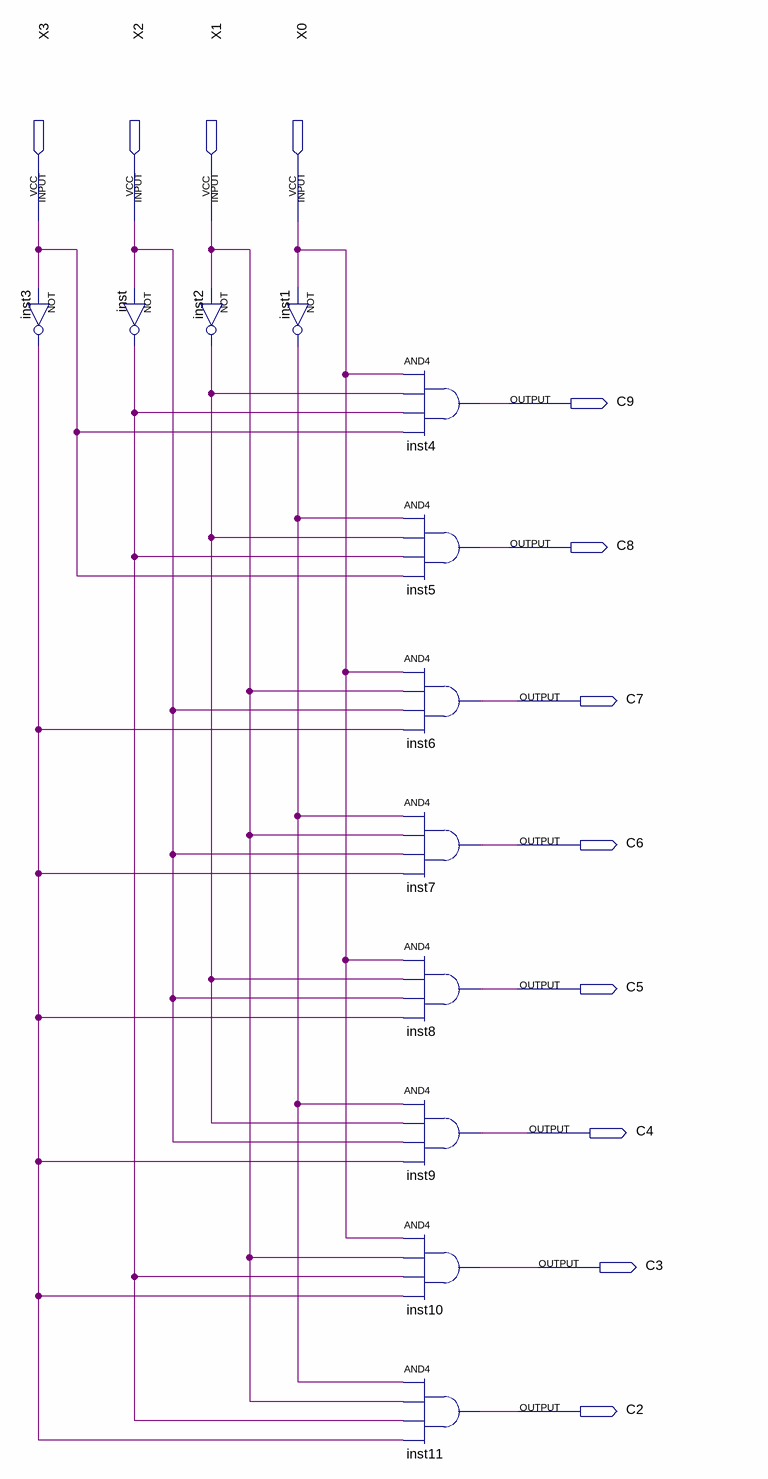
[diagram p0: schematic sheet]
// Quartus schematic lab2.bdf as structural Verilog: 12 symbols, 12 pins
module lab2 (
  input  X3,
  input  X2,
  input  X1,
  input  X0,
  output C9,
  output C8,
  output C7,
  output C6,
  output C5,
  output C4,
  output C3,
  output C2
);

  wire inst1_out, inst2_out, inst3_out, inst_out;

  not inst3 (inst3_out, X3);
  not inst (inst_out, X2);
  not inst2 (inst2_out, X1);
  not inst1 (inst1_out, X0);
  and inst4 (C9, X0, inst2_out, inst_out, X3);
  and inst5 (C8, inst1_out, inst2_out, inst_out, X3);
  and inst6 (C7, X0, X1, X2, inst3_out);
  and inst7 (C6, inst1_out, X1, X2, inst3_out);
  and inst8 (C5, X0, inst2_out, X2, inst3_out);
  and inst9 (C4, inst1_out, inst2_out, X2, inst3_out);
  and inst10 (C3, X0, X1, inst_out, inst3_out);
  and inst11 (C2, inst1_out, X1, inst_out, inst3_out);
endmodule
